# Altium schematic sheet PhaseCurrents.SchDoc: Title
size A4; SchTemplateVer: V2.0; Author: Adam Mizerkiewicz; CompanyName: Adam Mizerkiewicz; DrawnBy: Adam Mizerkiewicz; Engineer: Adam Mizerkiewicz; Organization: Adam Mizerkiewicz; Address1: Sarnia 2/19; Address2: 61-058 Poznań; Revision: 0.0; SheetNumber: 9; SheetTotal: 17
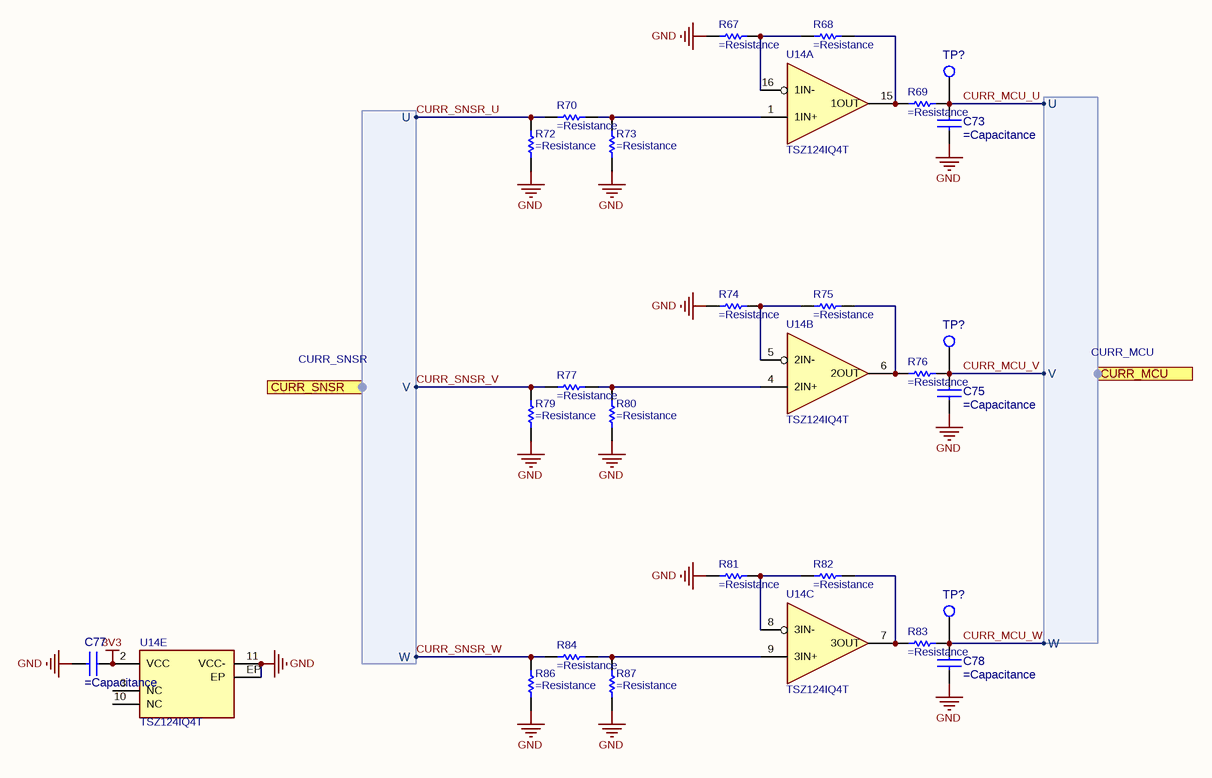
[diagram p0: PhaseCurrents.SchDoc]

## Parts
(Parts that share a designator on the sheet are numbered #1, #2 ... from top to bottom, then left to right.)
C73  (no value)  [C0402]
C75  (no value)  [C0402]
C77  (no value)  [C0402]
C78  (no value)  [C0402]
R67  (no value)  [R0402]
R68  (no value)  [R0402]
R69  (no value)  [R0402]
R70  (no value)  [R0402]
R72  (no value)  [R0402]
R73  (no value)  [R0402]
R74  (no value)  [R0402]
R75  (no value)  [R0402]
R76  (no value)  [R0402]
R77  (no value)  [R0402]
R79  (no value)  [R0402]
R80  (no value)  [R0402]
R81  (no value)  [R0402]
R82  (no value)  [R0402]
R83  (no value)  [R0402]
R84  (no value)  [R0402]
R86  (no value)  [R0402]
R87  (no value)  [R0402]
TP?#1  TP_SMT  [TP_SMT]  (value not drawn)  (no BOM)
TP?#2  TP_SMT  [TP_SMT]  (value not drawn)  (no BOM)
TP?#3  TP_SMT  [TP_SMT]  (value not drawn)  (no BOM)
U14  TSZ124IQ4T  [VQFN16]  (parts A,B,C,E of 5)

## Ports
CURR_MCU (harness CURR_MCU), CURR_SNSR (harness CURR_SNSR)

## Harnesses
CURR_SNSR: V, U, W
CURR_MCU: V, U, W

## Nets
3V3: C77.1 U14.2(VCC)
GND: C73.2 C75.2 C77.2 C78.2 R67.1 R72.1 R73.1 R74.1 R79.1 R80.1 R81.1 R86.1 R87.1 U14.11(VCC-) U14.EP
CURR_MCU_U: C73.1 R69.2 TP?#1.1 ; port CURR_MCU.U
CURR_MCU_V: C75.1 R76.2 TP?#2.1 ; port CURR_MCU.V
CURR_MCU_W: C78.1 R83.2 TP?#3.1 ; port CURR_MCU.W
CURR_SNSR_U: R70.1 R72.2 ; port CURR_SNSR.U
CURR_SNSR_V: R77.1 R79.2 ; port CURR_SNSR.V
CURR_SNSR_W: R84.1 R86.2 ; port CURR_SNSR.W
NetR67_2: R67.2 R68.1 U14.16(1IN-)
NetR68_2: R68.2 R69.1 U14.15(1OUT)
NetR70_2: R70.2 R73.2 U14.1(1IN+)
NetR74_2: R74.2 R75.1 U14.5(2IN-)
NetR75_2: R75.2 R76.1 U14.6(2OUT)
NetR77_2: R77.2 R80.2 U14.4(2IN+)
NetR81_2: R81.2 R82.1 U14.8(3IN-)
NetR82_2: R82.2 R83.1 U14.7(3OUT)
NetR84_2: R84.2 R87.2 U14.9(3IN+)

Not connected (* = marked no-connect by the designer): U14 3(NC) 10(NC)

## Notes on the sheet
- Revision
  =Revision
- Sheet
  =SheetNumber / =SheetTotal

## Library data of the parts
C73 C75 C78 = CAP0402-6.8nF-25V: Multilayer Ceramic Capacitors MLCC - SMD/SMT 25V 6800pF X7R 0402 10% AEC-Q200; Manufacturer: KEMET; Manufacturer Part Number: C0402C682K3RACAUTO; Capacitance: 6.8nF; Value: 6.8nF; Supplier 1: DigiKey; Supplier Part Number 1: 399-C0402C682K3RACAUTOCT-ND; Supplier: DigiKey; Supplier Part Number: 399-C0402C682K3RACAUTOCT-ND; RoHS: Compliant; Category: Ceramic Capacitors; Stock: 9600; Pricing: 1=0,26, 10=0,122, 50=0,075, 100=0,0595, 500=0,0515 (USD); Case/Package: 0402; China RoHS: Compliant; Dielectric: X7R; Dielectric Material: Ceramic; Height: 500µm; Length: 1mm; Lifecycle Status: Production; Material: Ceramic; Max Operating Temperature: 125°C; Min Operating Temperature: -55°C; Mounting Technology: Surface Mount; Pins: 2; Number of Terminals: 2; REACH SVHC: Yes; Voltage Rating: 25V; Voltage Rating (DC): 25V; Width: 500µm; ComponentLink1URL: https://datasheet.octopart.com:443/C0402C682K3RACAUTO-KEMET-datasheet-178087915.pdf?src-supplier=IHS; ComponentLink1Description: https://datasheet.octopart.com:443/C0402C682K3RACAUTO-KEMET-datasheet-178087915.pdf?src-supplier=IHS; ComponentLink2URL: https://datasheet.octopart.com:443/C0402C682K3RACAUTO-KEMET-datasheet-137357759.pdf?src-supplier=Upverter; ComponentLink2Description: https://datasheet.octopart.com:443/C0402C682K3RACAUTO-KEMET-datasheet-137357759.pdf?src-supplier=Upverter; ComponentLink3URL: https://datasheet.octopart.com:443/C0402C682K3RACAUTO-KEMET-datasheet-153706760.pdf?src-supplier=Electro+Sonic; ComponentLink3Description: https://datasheet.octopart.com:443/C0402C682K3RACAUTO-KEMET-datasheet-153706760.pdf?src-supplier=Electro+Sonic; ComponentLink4URL: https://datasheet.octopart.com:443/C0402C682K3RACAUTO-KEMET-datasheet-138896278.pdf?src-supplier=Farnell; ComponentLink4Description: https://datasheet.octopart.com:443/C0402C682K3RACAUTO-KEMET-datasheet-138896278.pdf?src-supplier=Farnell; ComponentLink5URL: https://datasheet.octopart.com/C0402C682K3RACAUTO-KEMET-datasheet-84169754.pdf; ComponentLink5Description: https://datasheet.octopart.com/C0402C682K3RACAUTO-KEMET-datasheet-84169754.pdf
C77 = CAP0402-0.1uF-50V: CAP CER 0.1UF 50V X7R 0402; Manufacturer: Walsin Technologies; Manufacturer Part Number: 0402B104K500CT; Capacitance: 100nF; Material: 4241ConductorMaterial; Value: 100nF; Tolerance: 10%; Dielectric: 1511DielectricType; Supplier: Digikey; Supplier Part Number: 1292-1176-1-ND; RoHS: Yes; Category: Ceramic Capacitors; Stock: 109567; Pricing: 1=0,08, 10=0,005, 100=0,0032, 1000=0,0024 (USD); Mounting Technology: Surface Mount; Case/Package: 0402; Case Code (Imperial): 0402; Case Code (Metric): 1005; Min Operating Temperature: -55°C; Max Operating Temperature: 125°C; Packaging: Cut Tape; Voltage Rating: 50V; Series: -; Voltage Rating (DC): 50V; Height: 550um; RoHS Compliant: Yes; Lead Free: 5697LeadFree; ComponentLink1URL: http://datasheet.octopart.com/0402B104K500CT-Walsin-Technologies-datasheet-26371553.pdf?src-supplier=Arrow+Electronics; ComponentLink1Description: http://datasheet.octopart.com/0402B104K500CT-Walsin-Technologies-datasheet-26371553.pdf?src-supplier=Arrow+Electronics; ComponentLink2URL: http://datasheet.octopart.com/0402B104K500CT-Walsin-Technologies-datasheet-26371553.pdf?src-supplier=Verical; ComponentLink2Description: http://datasheet.octopart.com/0402B104K500CT-Walsin-Technologies-datasheet-26371553.pdf?src-supplier=Verical; ComponentLink3URL: http://www.passivecomponent.com/indexsea/0402B104K500CT-IE.pdf?src-supplier=Digikey; ComponentLink3Description: http://www.passivecomponent.com/indexsea/0402B104K500CT-IE.pdf?src-supplier=Digikey; ComponentLink4URL: http://datasheet.octopart.com/0402B104K500CT-Walsin-Technologies-datasheet-26371553.pdf?src-supplier=Rs; ComponentLink4Description: http://datasheet.octopart.com/0402B104K500CT-Walsin-Technologies-datasheet-26371553.pdf?src-supplier=Rs; ComponentLink5URL: https://datasheet.octopart.com/0402B104K500CT-Walsin-Technologies-datasheet-128065749.pdf?src-supplier=Future+Electronics; ComponentLink5Description: https://datasheet.octopart.com/0402B104K500CT-Walsin-Technologies-datasheet-128065749.pdf?src-supplier=Future+Electronics; ComponentLink6URL: http://datasheet.octopart.com/0402B104K500CT-Walsin-Technologies-datasheet-26371553.pdf?src-supplier=Farnell; ComponentLink6Description: http://datasheet.octopart.com/0402B104K500CT-Walsin-Technologies-datasheet-26371553.pdf?src-supplier=Farnell; ComponentLink7URL: http://datasheet.octopart.com/0402B104K500CT-Walsin-Technologies-datasheet-26371553.pdf?src-supplier=Newark; ComponentLink7Description: http://datasheet.octopart.com/0402B104K500CT-Walsin-Technologies-datasheet-26371553.pdf?src-supplier=Newark; ComponentLink8URL: http://datasheet.octopart.com/0402B104K500CT-Walsin-Technologies-datasheet-26371553.pdf?src-supplier=Mouser; ComponentLink8Description: http://datasheet.octopart.com/0402B104K500CT-Walsin-Technologies-datasheet-26371553.pdf?src-supplier=Mouser; ComponentLink9URL: http://datasheet.octopart.com/0402B104K500CT-Walsin-Technologies-datasheet-26371553.pdf?src-supplier=Digikey; ComponentLink9Description: http://datasheet.octopart.com/0402B104K500CT-Walsin-Technologies-datasheet-26371553.pdf?src-supplier=Digikey; ComponentLink10URL: https://datasheet.octopart.com/0402B104K500CT-Walsin-Technologies-datasheet-62066062.pdf?src-supplier=TME; ComponentLink10Description: https://datasheet.octopart.com/0402B104K500CT-Walsin-Technologies-datasheet-62066062.pdf?src-supplier=TME; ComponentLink11URL: http://datasheet.octopart.com/0402B104K500CT-Walsin-Technologies-datasheet-26371553.pdf?src-supplier=Freelance+Electronics; ComponentLink11Description: http://datasheet.octopart.com/0402B104K500CT-Walsin-Technologies-datasheet-26371553.pdf?src-supplier=Freelance+Electronics; ComponentLink12URL: http://datasheet.octopart.com/0402B104K500CT-Walsin-Technologies-datasheet-26371553.pdf?src-supplier=Component+Sense; ComponentLink12Description: http://datasheet.octopart.com/0402B104K500CT-Walsin-Technologies-datasheet-26371553.pdf?src-supplier=Component+Sense; ComponentLink13URL: http://datasheet.octopart.com/0402B104K500CT-Walsin-Technologies-datasheet-26371553.pdf?src-supplier=NAC+Semi; ComponentLink13Description: http://datasheet.octopart.com/0402B104K500CT-Walsin-Technologies-datasheet-26371553.pdf?src-supplier=NAC+Semi; ComponentLink14URL: https://datasheet.octopart.com/0402B104K500CT-Walsin-Technologies-datasheet-136037192.pdf?src-supplier=TECHDesign; ComponentLink14Description: https://datasheet.octopart.com/0402B104K500CT-Walsin-Technologies-datasheet-136037192.pdf?src-supplier=TECHDesign; Supplier 1: Digikey; Supplier Part Number 1: 1292-1176-1-ND
R67 R68 R74 R75 R81 R82 = RES0402-10k-1%: Res Thick Film 0402 10K Ohm 1% 0.063W(1/16W) ±100ppm/C Pad SMD T/R Automotive AEC-Q200; Manufacturer: Vishay; Manufacturer Part Number: CRCW040210K0FKEE; Resistance: 10kΩ; Max Power Dissipation: 63mW; Value: 10kΩ; Temperature Coefficient: 100ppm/°C; Voltage Rating: 50V; Supplier 1: DigiKey; Supplier Part Number 1: 541-2954-1-ND; Supplier: DigiKey; Supplier Part Number: 541-2954-1-ND; RoHS: Compliant; Category: Chip SMD Resistors; Pricing: 1=0,1, 10=0,03, 25=0,0224, 50=0,018, 100=0,0148, 250=0,01156, 500=0,00974, 1000=0,00832, 5000=0,00637 (USD); Case/Package: 0402; Case Code (Imperial): 0402; Case Code (Metric): 1005; China RoHS: Non-Compliant; Composition: Thick Film; Contact Plating: Tin; Depth: 500µm; Features: Automotive AEC-Q200; Height: 350µm; Lead Free: Lead Free; Length: 990.6µm; Lifecycle Status: Production; Max Operating Temperature: 155°C; Military Standard: Not; Min Operating Temperature: -55°C; Mounting Technology: Surface Mount; Number of Terminals: 2; Number of Terminations: 2; Packaging: Tape & Reel; Power Dissipation: 63mW; Power Rating: 63mW; Radiation Hardening: No; REACH SVHC: Yes; Schedule B: 8533210045, 8533210045|8533210045|8533210045|8533210045|8533210045|8533210045|8533210045|8533210045|8533210045|8533210045|8533210045|8533210045|8533210045|8533210045|8533210045|8533210045|8533210045|8533210045|8533210045|8533210045|8533210045|8533210045|8533210045|85; Tolerance: 1%; Voltage Rating (DC): 50V; Width: 500µm; Working Voltage: 50V; ComponentLink1URL: https://datasheet.octopart.com:443/CRCW040210K0FKEE-Vishay-datasheet-175423584.pdf?src-supplier=IHS; ComponentLink1Description: https://datasheet.octopart.com:443/CRCW040210K0FKEE-Vishay-datasheet-175423584.pdf?src-supplier=IHS; ComponentLink2URL: https://datasheet.octopart.com:443/CRCW040210K0FKEE-Vishay-datasheet-62316122.pdf?src-supplier=Future+Electronics; ComponentLink2Description: https://datasheet.octopart.com:443/CRCW040210K0FKEE-Vishay-datasheet-62316122.pdf?src-supplier=Future+Electronics; ComponentLink3URL: http://sigma.octopart.com:80/rohs_statement/Vishay-company-15.pdf?src-supplier=Compliance+Statements; ComponentLink3Description: http://sigma.octopart.com:80/rohs_statement/Vishay-company-15.pdf?src-supplier=Compliance+Statements
R69 R76 R83 = RES0402-1k-1%: Res Thick Film 0402 1K Ohm 1% 0.063W(1/16W) ±50ppm/C Pad SMD Automotive T/R; Manufacturer: Vishay; Manufacturer Part Number: CRCW04021K00FHEDP; Resistance: 1kΩ; Max Power Dissipation: 63mW; Value: 1kΩ; Temperature Coefficient: 50ppm/°C; Voltage Rating: 50V; Supplier 1: DigiKey; Supplier Part Number 1: CRCW04021K00FHEDP-ND; Supplier: DigiKey; Supplier Part Number: CRCW04021K00FHEDP-ND; RoHS: Compliant; Category: Chip SMD Resistors; Pricing: 10000=0,03252 (USD); Case/Package: 0402; China RoHS: Non-Compliant; Composition: Thick Film; Contact Plating: Tin; Depth: 500µm; Features: Automotive AEC-Q200; Height: 350µm; Length: 990.6µm; Lifecycle Status: Production; Max Operating Temperature: 155°C; Military Standard: Not; Min Operating Temperature: -55°C; Mounting Technology: Surface Mount; Number of Terminals: 2; Number of Terminations: 2; Packaging: Tape & Reel; Power Dissipation: 63mW; Power Rating: 63mW; Radiation Hardening: No; REACH SVHC: Yes; Tolerance: 1%; Width: 500µm; Working Voltage: 50V; ComponentLink1URL: https://datasheet.octopart.com:443/CRCW04021K00FHEDP-Vishay-datasheet-182027415.pdf?src-supplier=IHS; ComponentLink1Description: https://datasheet.octopart.com:443/CRCW04021K00FHEDP-Vishay-datasheet-182027415.pdf?src-supplier=IHS; ComponentLink2URL: https://datasheet.octopart.com:443/CRCW04021K00FHEDP-Vishay-Dale-datasheet-141207190.pdf?src-supplier=Upverter; ComponentLink2Description: https://datasheet.octopart.com:443/CRCW04021K00FHEDP-Vishay-Dale-datasheet-141207190.pdf?src-supplier=Upverter; ComponentLink3URL: http://sigma.octopart.com:80/rohs_statement/Vishay-company-15.pdf?src-supplier=Compliance+Statements; ComponentLink3Description: http://sigma.octopart.com:80/rohs_statement/Vishay-company-15.pdf?src-supplier=Compliance+Statements
R70 R77 R84 = RES0402-20k-1%: Res Thick Film 0402 20K Ohm 1% 0.063W(1/16W) ±100ppm/C Pad SMD T/R; Manufacturer: Vishay; Manufacturer Part Number: CRCW040220K0FKEDC; Resistance: 20kΩ; Power Dissipation: 63mW; Value: 20kΩ; Temperature Coefficient: 100ppm/°C; Voltage Rating: 50V; Supplier 1: DigiKey; Supplier Part Number 1: 541-3969-1-ND; Supplier: DigiKey; Supplier Part Number: 541-3969-1-ND; RoHS: Compliant; Category: Chip SMD Resistors; Stock: 7862; Pricing: 1=0,1, 10=0,028, 25=0,0208, 50=0,0168, 100=0,0138, 250=0,01072, 500=0,009, 1000=0,00766, 5000=0,00554 (USD); Case/Package: 0402; China RoHS: Non-Compliant; Composition: Thick Film; Contact Plating: Tin; Height: 300µm; Lead Free: Lead Free; Length: 1mm; Lifecycle Status: Production; Max Operating Temperature: 155°C; Min Operating Temperature: -55°C; Mounting Technology: Surface Mount; Number of Terminals: 2; Power Rating: 63mW; REACH SVHC: Yes; Schedule B: 8533210045, 8533210045|8533210045|8533210045|8533210045|8533210045; Termination: Wraparound; Tolerance: 1%; Width: 500µm; Working Voltage: 50V; ComponentLink1URL: https://datasheet.octopart.com:443/CRCW040220K0FKEDC-Vishay-datasheet-102570912.pdf?src-supplier=Upverter; ComponentLink1Description: https://datasheet.octopart.com:443/CRCW040220K0FKEDC-Vishay-datasheet-102570912.pdf?src-supplier=Upverter; ComponentLink2URL: https://datasheet.octopart.com:443/CRCW040220K0FKEDC-Vishay-datasheet-175423585.pdf?src-supplier=IHS; ComponentLink2Description: https://datasheet.octopart.com:443/CRCW040220K0FKEDC-Vishay-datasheet-175423585.pdf?src-supplier=IHS; ComponentLink3URL: https://datasheet.octopart.com:443/CRCW040220K0FKEDC-Vishay-datasheet-100063072.pdf?src-supplier=Future+Electronics; ComponentLink3Description: https://datasheet.octopart.com:443/CRCW040220K0FKEDC-Vishay-datasheet-100063072.pdf?src-supplier=Future+Electronics; ComponentLink4URL: https://datasheet.octopart.com:443/CRCW040220K0FKEDC-Vishay-datasheet-62316122.pdf?src-supplier=Future+Electronics; ComponentLink4Description: https://datasheet.octopart.com:443/CRCW040220K0FKEDC-Vishay-datasheet-62316122.pdf?src-supplier=Future+Electronics; ComponentLink5URL: http://sigma.octopart.com:80/rohs_statement/Vishay-company-15.pdf?src-supplier=Compliance+Statements; ComponentLink5Description: http://sigma.octopart.com:80/rohs_statement/Vishay-company-15.pdf?src-supplier=Compliance+Statements
R72 R79 R86 = RES0402-100k-1%: Res Thick Film 0402 100K Ohm 1% 0.063W(1/16W) ±100ppm/C Molded SMD Automotive Paper T/R; Manufacturer: Vishay; Manufacturer Part Number: CRCW0402100KFKEE; Resistance: 100kΩ; Max Power Dissipation: 63mW; Value: 100kΩ; Temperature Coefficient: 100ppm/°C; Voltage Rating: 50V; Supplier 1: DigiKey; Supplier Part Number 1: 541-CRCW0402100KFKEECT-ND; Supplier: DigiKey; Supplier Part Number: 541-CRCW0402100KFKEECT-ND; RoHS: Compliant; Category: Chip SMD Resistors; Stock: 14497; Pricing: 1=0,1, 10=0,03, 25=0,0224, 50=0,018, 100=0,0148, 250=0,01156, 500=0,00974, 1000=0,00832, 5000=0,00606 (USD); Case/Package: 0402; China RoHS: Non-Compliant; Composition: Thick Film; Contact Plating: Tin; Depth: 500µm; Features: Automotive AEC-Q200; Height: 350µm; Lead Free: Lead Free; Length: 990.6µm; Lifecycle Status: Production; Max Operating Temperature: 155°C; Military Standard: Not; Min Operating Temperature: -55°C; Mounting Technology: Surface Mount; Number of Terminals: 2; Number of Terminations: 2; Packaging: Tape & Reel; Power Dissipation: 63mW; Power Rating: 63mW; Radiation Hardening: No; REACH SVHC: Yes; Schedule B: 8533210045, 8533210045|8533210045|8533210045|8533210045|8533210045|8533210045|8533210045|8533210045|8533210045|8533210045|8533210045|8533210045|8533210045|8533210045|8533210045|8533210045|8533210045|8533210045|8533210045|8533210045|8533210045|8533210045|8533210045|85; Tolerance: 1%; Voltage Rating (DC): 50V; Width: 500µm; Working Voltage: 50V; ComponentLink1URL: https://datasheet.octopart.com:443/CRCW0402100KFKEE-Vishay-datasheet-175423584.pdf?src-supplier=IHS; ComponentLink1Description: https://datasheet.octopart.com:443/CRCW0402100KFKEE-Vishay-datasheet-175423584.pdf?src-supplier=IHS; ComponentLink2URL: https://datasheet.octopart.com:443/CRCW0402100KFKEE-Vishay-datasheet-190005712.pdf?src-supplier=TME; ComponentLink2Description: https://datasheet.octopart.com:443/CRCW0402100KFKEE-Vishay-datasheet-190005712.pdf?src-supplier=TME; ComponentLink3URL: https://datasheet.octopart.com:443/CRCW0402100KFKEE-Vishay-datasheet-62316122.pdf?src-supplier=Future+Electronics; ComponentLink3Description: https://datasheet.octopart.com:443/CRCW0402100KFKEE-Vishay-datasheet-62316122.pdf?src-supplier=Future+Electronics; ComponentLink4URL: https://datasheet.octopart.com/D-CRCW-e3-Standard-Thick-Film-Chip-Resistors-Vishay-datasheet-family-64.pdf; ComponentLink4Description: https://datasheet.octopart.com/D-CRCW-e3-Standard-Thick-Film-Chip-Resistors-Vishay-datasheet-family-64.pdf; ComponentLink5URL: http://sigma.octopart.com:80/rohs_certificate/D-CRCW-e3-Standard-Thick-Film-Chip-Resistors-Vishay-family-102.pdf?src-supplier=Compliance+Statements; ComponentLink5Description: http://sigma.octopart.com:80/rohs_certificate/D-CRCW-e3-Standard-Thick-Film-Chip-Resistors-Vishay-family-102.pdf?src-supplier=Compliance+Statements
R73 R80 R87 = RES0402-30k-1%: 0402 30K Ohms 1% High Power Thick Film Surface Mount Chip Resistor; Manufacturer: Vishay; Manufacturer Part Number: CRCW040230K0FKEDHP; Manufacturer Package Identifier: CRCW0402-HPe3; Resistance: 30kΩ; Max Power Dissipation: 125mW; Power Dissipation: 200mW; Value: 30kΩ; Temperature Coefficient: 100ppm/°C; Voltage Rating: 50V; Supplier 1: DigiKey; Supplier Part Number 1: CRCW040230K0FKEDHPCT-ND; Supplier: DigiKey; Supplier Part Number: CRCW040230K0FKEDHPCT-ND; RoHS: Compliant; Category: Chip SMD Resistors; Stock: 9449; Pricing: 1=0,13, 10=0,061, 25=0,0472, 50=0,0392, 100=0,0331, 250=0,027, 500=0,0235, 1000=0,02072, 5000=0,01631 (USD); Case/Package: 0402; Case Code (Imperial): 0402; Case Code (Metric): 1005; China RoHS: Non-Compliant; Composition: Thick Film; Contact Plating: Tin; Features: Automotive AEC-Q200; Height: 300µm; Lead Free: Lead Free; Length: 990.6µm; Lifecycle Status: Production; Max Operating Temperature: 155°C; Min Operating Temperature: -55°C; Mounting Technology: Surface Mount; Number of Terminals: 2; Number of Terminations: 2; Packaging: Digi-Reel®; Power Rating: 200mW; Radiation Hardening: No; REACH SVHC: Yes; Tolerance: 1%; Width: 500µm; Working Voltage: 50V; ComponentLink1URL: https://datasheet.octopart.com/CRCW040230K0FKEDHP-Vishay-datasheet-83567917.pdf; ComponentLink1Description: https://datasheet.octopart.com/CRCW040230K0FKEDHP-Vishay-datasheet-83567917.pdf; ComponentLink2URL: https://datasheet.octopart.com/D-CRCW-e3-Standard-Thick-Film-Chip-Resistors-Vishay-datasheet-family-64.pdf; ComponentLink2Description: https://datasheet.octopart.com/D-CRCW-e3-Standard-Thick-Film-Chip-Resistors-Vishay-datasheet-family-64.pdf; ComponentLink3URL: https://datasheet.octopart.com:443/CRCW040230K0FKEDHP-Vishay-datasheet-137113427.pdf?src-supplier=X-ON; ComponentLink3Description: https://datasheet.octopart.com:443/CRCW040230K0FKEDHP-Vishay-datasheet-137113427.pdf?src-supplier=X-ON; ComponentLink4URL: https://datasheet.octopart.com:443/CRCW040230K0FKEDHP-Vishay-datasheet-62316122.pdf?src-supplier=Future+Electronics; ComponentLink4Description: https://datasheet.octopart.com:443/CRCW040230K0FKEDHP-Vishay-datasheet-62316122.pdf?src-supplier=Future+Electronics; ComponentLink5URL: http://sigma.octopart.com:80/rohs_certificate/D-CRCW-e3-Standard-Thick-Film-Chip-Resistors-Vishay-family-102.pdf?src-supplier=Compliance+Statements; ComponentLink5Description: http://sigma.octopart.com:80/rohs_certificate/D-CRCW-e3-Standard-Thick-Film-Chip-Resistors-Vishay-family-102.pdf?src-supplier=Compliance+Statements
TP?#1-TP?#3 = TP: TEST POINT
U14 = TSZ124IQ4T: TSZ124 Series 5.5V 400 kHz Rail to Rail SMT Operational Amplifier - TSSOP-14; Manufacturer: STMicroelectronics; Bandwidth: 400kHz; Common Mode Rejection Ratio: 115dB; Input Bias Current: 200pA; Input Offset Voltage (Vos): 8µV; Max Supply Current: 40µA; Max Supply Voltage: 6V; Min Supply Voltage: 1.8V; Nominal Supply Current: 31µA; Number of Channels: 4; Operating Supply Voltage: 3.3V; Output Current: 17mA; Output Current per Channel: 18mA; Slew Rate: 0.19V/µs; Voltage Gain: 135dB; Supplier 1: DigiKey; Supplier Part Number 1: 497-14337-1-ND; Supplier: DigiKey; Supplier Part Number: 497-14337-1-ND; Manufacturer Part Number: TSZ124IQ4T; RoHS: Compliant; Category: Amplifiers - Op Amps, Buffer, Instrumentation; Stock: 10565; Pricing: 1=1,86, 10=1,367, 25=1,2444, 100=1,1092, 250=1,0448, 500=1,00596, 1000=0,97398 (USD); Case/Package: QFN; China RoHS: Compliant; Gain Bandwidth Product: 400kHz; Height - Seated (Max): 1mm; Length: 3mm; Lifecycle Status: Production; Max Operating Temperature: 125°C; Min Operating Temperature: -40°C; Mounting Technology: Surface Mount; Number of Circuits: 4; Pins: 16; Number of Terminals: 4; Operating Supply Current: 31µA; Packaging: Tape and Reel; REACH SVHC: Yes; Schedule B: 8542330000, 8542330000|8542330000|8542330000|8542330000|8542330000; Terminal Pitch: 500µm; Unity Gain Bandwidth Product: 400kHz; Width: 3mm; ComponentLink1URL: https://datasheet.octopart.com:443/TSZ124IQ4T-STMicroelectronics-datasheet-62337710.pdf?src-supplier=Future+Electronics; ComponentLink1Description: https://datasheet.octopart.com:443/TSZ124IQ4T-STMicroelectronics-datasheet-62337710.pdf?src-supplier=Future+Electronics; ComponentLink2URL: https://datasheet.octopart.com:443/TSZ124IQ4T-STMicroelectronics-datasheet-16350222.pdf?src-supplier=STMicroelectronics; ComponentLink2Description: https://datasheet.octopart.com:443/TSZ124IQ4T-STMicroelectronics-datasheet-16350222.pdf?src-supplier=STMicroelectronics; ComponentLink3URL: https://datasheet.octopart.com:443/TSZ124IQ4T-STMicroelectronics-datasheet-140259870.pdf?src-supplier=Farnell; ComponentLink3Description: https://datasheet.octopart.com:443/TSZ124IQ4T-STMicroelectronics-datasheet-140259870.pdf?src-supplier=Farnell; ComponentLink4URL: https://datasheet.octopart.com:443/TSZ124IQ4T-STMicroelectronics-datasheet-159009515.pdf?src-supplier=SHENGYU+ELECTRONICS; ComponentLink4Description: https://datasheet.octopart.com:443/TSZ124IQ4T-STMicroelectronics-datasheet-159009515.pdf?src-supplier=SHENGYU+ELECTRONICS; ComponentLink5URL: https://datasheet.octopart.com:443/TSZ124IQ4T-STMicroelectronics-datasheet-165583692.pdf?src-supplier=TME; ComponentLink5Description: https://datasheet.octopart.com:443/TSZ124IQ4T-STMicroelectronics-datasheet-165583692.pdf?src-supplier=TME